# Altium schematic sheet R45_PCBM.SchDoc
size A4; SheetNumber: 1; SheetTotal: 1
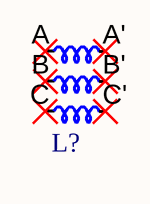
[diagram p0: R45_PCBM.SchDoc]

## Parts
L?  L_phase  [R45_stator]  (value not drawn)  (no BOM)

## Nets

Not connected (* = marked no-connect by the designer): L? A* A'* B* B'* C* C'*

## Notes on the sheet
- PROJECT
- PCB Revision:
- SIZE
- FILE NAME
- SHEET
- Guim Pedrero
  Electronics Design Engineer
- DATE
- A4

## Library data of the parts
L? = L_3phase